# EAGLE schematic MUR_V0.1_Wiring (EAGLE 9.5.2)
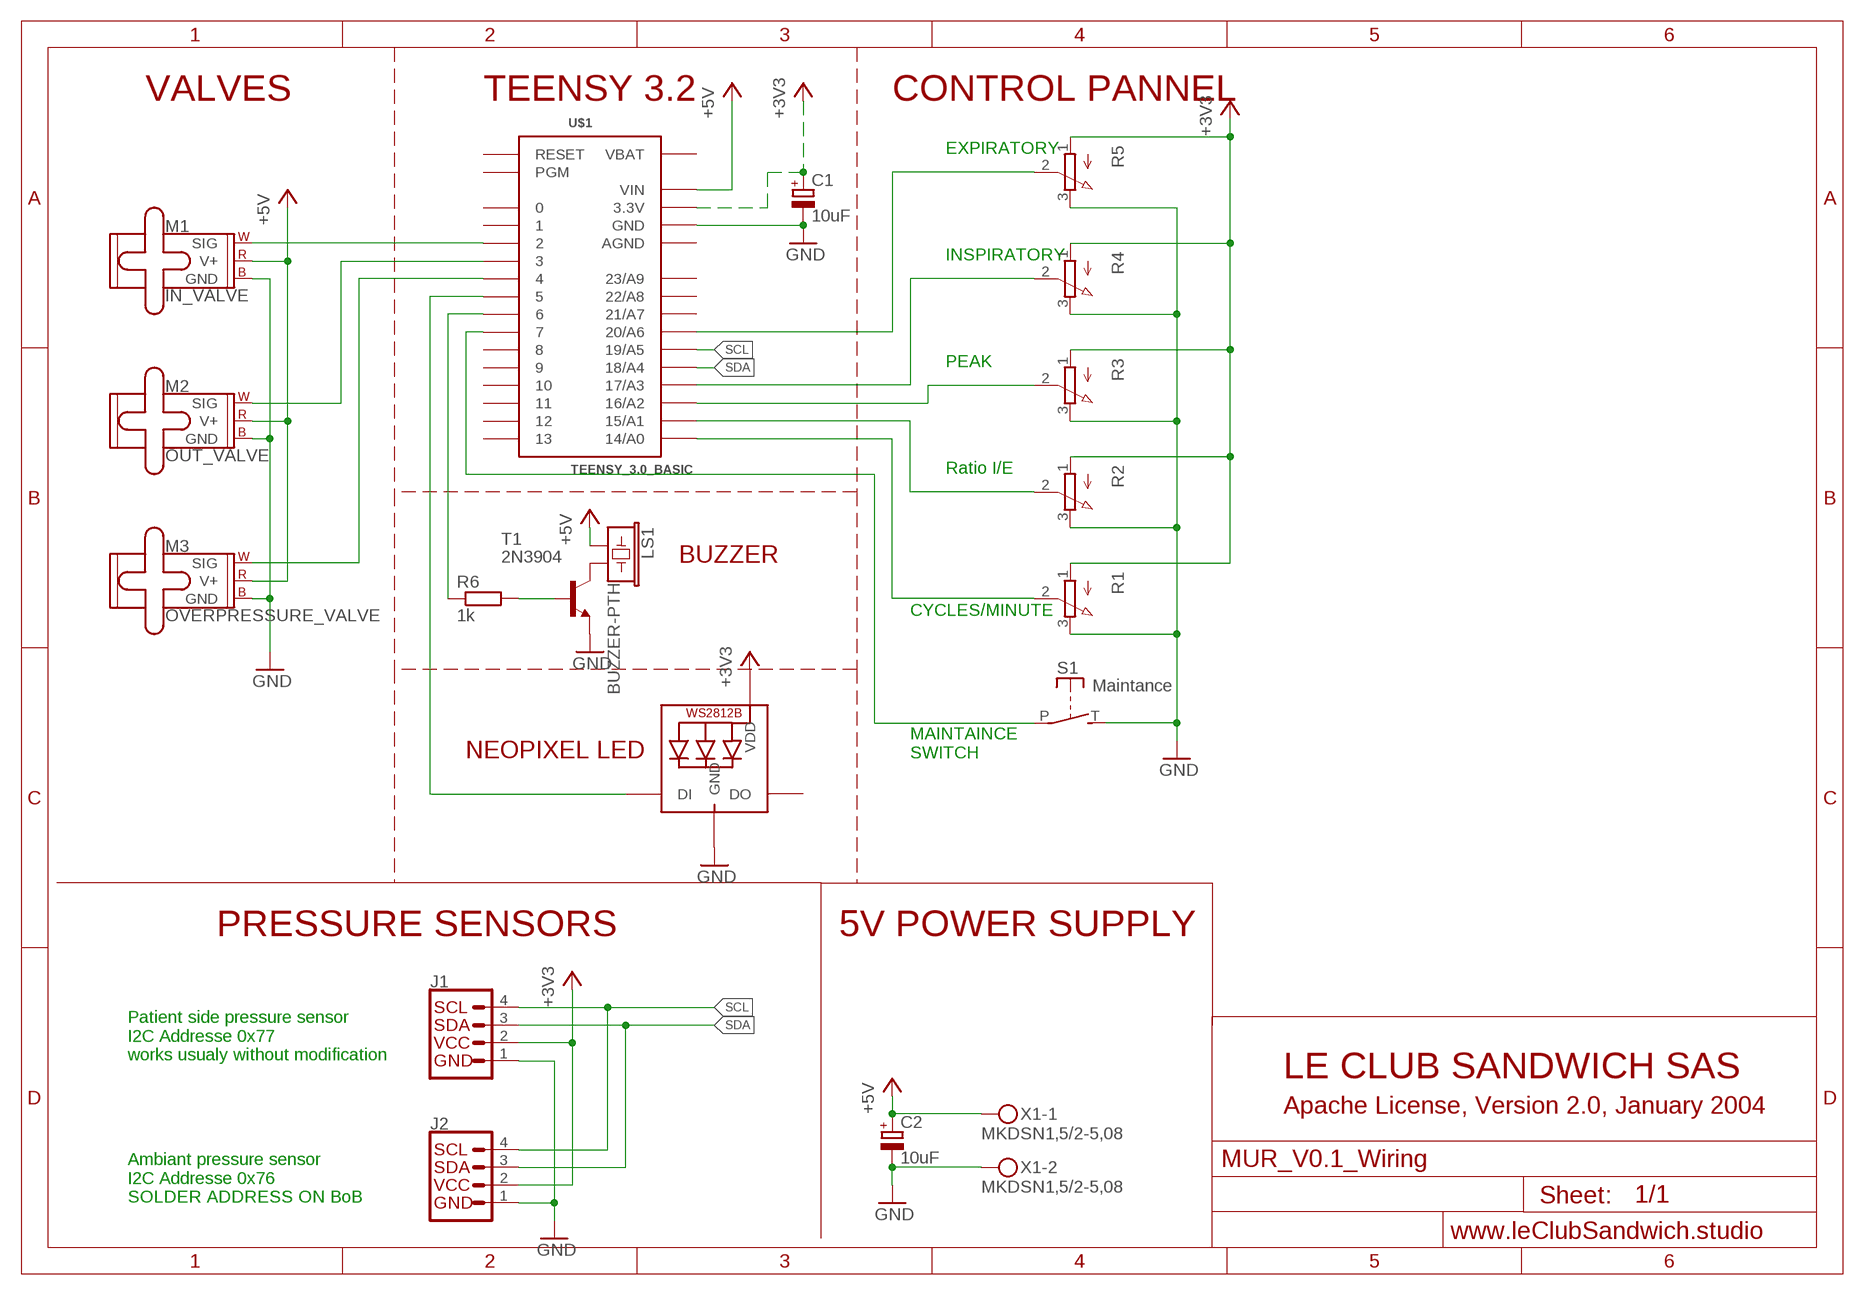
[diagram p0: schematic, sheet 1]

## Parts
C1  10uF  CPOL-EUE2.5-6  [E2,5-6]
C2  10uF  CPOL-EUE2.5-6  [E2,5-6]
J1  I2C_STANDARD_NO_SILK  [1X04_NO_SILK]
J2  I2C_STANDARD_NO_SILK  [1X04_NO_SILK]
LED1  WS2812B5050  [WS2812B]
LS1  BUZZER-PTH  [BUZZER-12MM]
M1  IN_VALVE  SERVO  [1X03]
M2  OUT_VALVE  SERVO  [1X03]
M3  OVERPRESSURE_VALVE  SERVO  [1X03]
R1  3RP/1610N  [3RP/1610N]
R2  3RP/1610N  [3RP/1610N]
R3  3RP/1610N  [3RP/1610N]
R4  3RP/1610N  [3RP/1610N]
R5  3RP/1610N  [3RP/1610N]
R6  1k  R-EU_0204/5  [0204/5]
S1  Maintance  SPST  [JUDCOSPST]
T1  2N3904  [TO92]
U$1  TEENSY_3.0_BASIC  [TEENSY_3.0_BASIC]
X1  MKDSN1,5/2-5,08  [MKDSN1,5/2-5,08]

## Nets
+3V3: C1.+ J1.2 J2.2 LED1.1-VDD(VDD) R1.1(A) R2.1(A) R3.1(A) R4.1(A) R5.1(A) U$1.3.3V U$1.3.3V1(3.3V)
+5V: C2.+ LS1.+ M1.2(V+) M2.2(V+) M3.2(V+) U$1.VIN X1.1
GND: C1.- C2.- J1.1 J2.1 LED1.3-GND(GND) M1.3(GND) M2.3(GND) M3.3(GND) R1.3(E) R2.3(E) R3.3(E) R4.3(E) R5.3(E) S1.T(S) T1.3(E) U$1.GND U$1.GND1(GND) X1.2
N$1: M1.1(SIG) U$1.2
N$2: M2.1(SIG) U$1.3
N$3: M3.1(SIG) U$1.4
N$4: R5.2(S) U$1.20/A6
N$5: S1.P U$1.7
N$6: R6.2 T1.2(B)
N$7: R2.2(S) U$1.15/A1
N$8: R3.2(S) U$1.16/A2
N$9: R4.2(S) U$1.17/A3
N$10: LS1.- T1.1(C)
N$11: R1.2(S) U$1.14/A0
N$12: R6.1 U$1.6
N$13: LED1.4-DIN(DI) U$1.5
SCL: J1.4 J2.4 U$1.19/A5
SDA: J1.3 J2.3 U$1.18/A4
Unconnected: LED1.2-DOUT(DO) U$1.0 U$1.1 U$1.8 U$1.9 U$1.10 U$1.11 U$1.12 U$1.13 U$1.21/A7 U$1.22/A8 U$1.23/A9 U$1.PGM U$1.RESET

## Notes on the sheet
- VALVES | TEENSY 3.2 | CONTROL PANNEL
- EXPIRATORY
- INSPIRATORY
- PEAK
- Ratio I/E
- BUZZER
- CYCLES/MINUTE
- NEOPIXEL LED
- MAINTAINCE
  SWITCH
- PRESSURE SENSORS | 5V POWER SUPPLY
- Patient side pressure sensor
  I2C Addresse 0x77
  works usualy without modification
- LE CLUB SANDWICH SAS
- Apache License, Version 2.0, January 2004
- Ambiant pressure sensor
  I2C Addresse 0x76
  SOLDER ADDRESS ON BoB

## Power pins joined to a net without a drawn wire
AGND: U$1.AGND
VBAT: U$1.VBAT

## Library data of the parts
C1 C2 = rcl:CPOL-EU: POLARIZED CAPACITOR, European symbol; SPICEPREFIX: C
J1 J2 = SparkFun-Connectors:I2C_STANDARD: SparkFun I2C Standard Pinout Header SparkFun has standardized on a pinout for all I2C based sensor breakouts. This pinout allows I2C boards to be plugged directly into the headers on Arduino Uno compatible boards, and to be daisy chained easily. Example SparkFun Products: SparkFun Atmospheric Sensor Breakout - BME280 <https://www.sparkfun.com/products/13676> SparkFun Altitude/Pressure Sensor Breakout - MPL3115A2 <https://www.sparkfun.com/products/11084> SparkFun TOF Range Finder Sensor - VL6180 <https://www.sparkfun.com/products/12785>
LED1 = adafruit:WS2812B
LS1 = SparkFun-Electromechanical:BUZZER: Buzzer Small round buzzers that operate around the audible 2kHz range. You can use these as speakers to create simple music or user interfaces. Variant Overview: PTH - Mini Speaker - PC Mount 12mm 2.048kHz <https://www.sparkfun.com/products/7950> PTH_KIT - Mini Speaker - PC Mount 12mm 2.048kHz <https://www.sparkfun.com/products/7950> KIT simplifies soldering by adding stop mask to one side of the pads. PTH_NO_SILK - Mini Speaker - PC Mount 12mm 2.048kHz <https://www.sparkfun.com/products/7950> No silkscreen indicator of buzzer outline. PTH_KIT_NO_SILK - Mini Speaker - PC Mount 12mm 2.048kHz <https://www.sparkfun.com/products/7950> KIT package w/o silkscreen SMD - Buzzer Audio Magnetic (CCV-084B16) SMD buzzer used on, e.g. the LilyPad Buzzer <https://www.sparkfun.com/products/8463> and RFID USB Reader <https://www.sparkfun.com/products/9963>. SMD_KIT - Buzzer Audio Magnetic (CCV-084B16) SMD Buzzer with elongated pins to make soldering easier. Used on the SparkFun Simon Says - Surface Mount Soldering Kit <https://www.sparkfun.com/products/10935>.; PROD_ID: COMP-08253; SF_SKU: COM-07950
M1-M3 = SparkFun-Electromechanical:SERVO: Servo Motor 3-pin connector for a standard servo motor (voltage supply, ground, and control signal.) SparkFun Products Servo - Generic (Sub-Micro Size) <https://www.sparkfun.com/products/9065> (ROB-09065) Servo - Generic High Torque Continuous Rotation (Standard Size) <https://www.sparkfun.com/products/9347> (ROB-09347) Servo - Generic High Torque (Standard Size) <https://www.sparkfun.com/products/11965> (ROB-11965)
R1-R5 = pot:3RP/1610N: 16mm Potentiometer one level Source: http://www.alphapotentiometers.net/html/16mm_pot_2.html
R6 = rcl:R-EU_: RESISTOR, European symbol; SPICEPREFIX: R
S1 = adafruit:SPST: Judco 50-0015-00
T1 = transistor:2N3904: NPN TRANSISTOR
U$1 = Teensy_3_Series_Board_v1.0:TEENSY_3.0_BASIC: Basic Teensy 3.0 with none of the 'inner' pins enabled. See '+4', 'AllAnalogPins", and 'AllPins' packages for additional pin holes, as needed.
X1 = con-phoenix-508:MKDSN1,5/2-5,08: MKDSN 1,5/ 2-5,08 Printklemme Nennstrom: 13,5 A Nennspannung: 250 V Rastermaß: 5,08 mm Polzahl: 2 Anschlussart: Schraubanschluss Montage: Löten Anschlussrichtung Leiter/Platine: 0 ° Artikelnummer: 1729128 Source: http://eshop.phoenixcontact.com .. 1729128.pdf